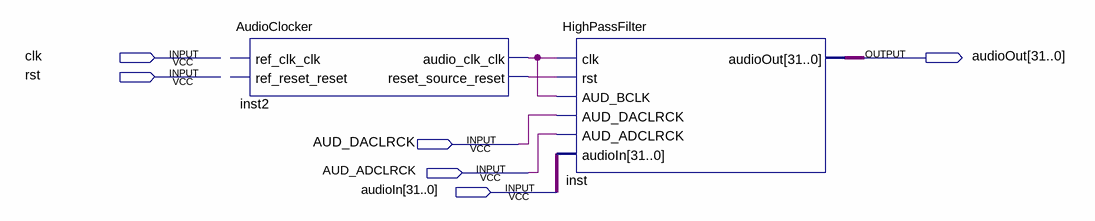
[diagram p0: schematic sheet]
// Quartus schematic HPF.bdf as structural Verilog: 2 symbols, 6 pins
module HPF (
  input  clk,
  input  rst,
  input  AUD_DACLRCK,
  input  AUD_ADCLRCK,
  input  [31:0] audioIn,
  output [31:0] audioOut
);

  wire inst2_audio_clk_clk, inst2_reset_source_reset;

  AudioClocker inst2 (
    .audio_clk_clk(inst2_audio_clk_clk), .reset_source_reset(inst2_reset_source_reset));  // open: ref_clk_clk, ref_reset_reset
  HighPassFilter inst (
    .clk(inst2_audio_clk_clk), .rst(inst2_reset_source_reset), .AUD_BCLK(inst2_audio_clk_clk),
    .AUD_DACLRCK(AUD_DACLRCK), .AUD_ADCLRCK(AUD_ADCLRCK), .audioIn(audioIn), .audioOut(audioOut));
endmodule
